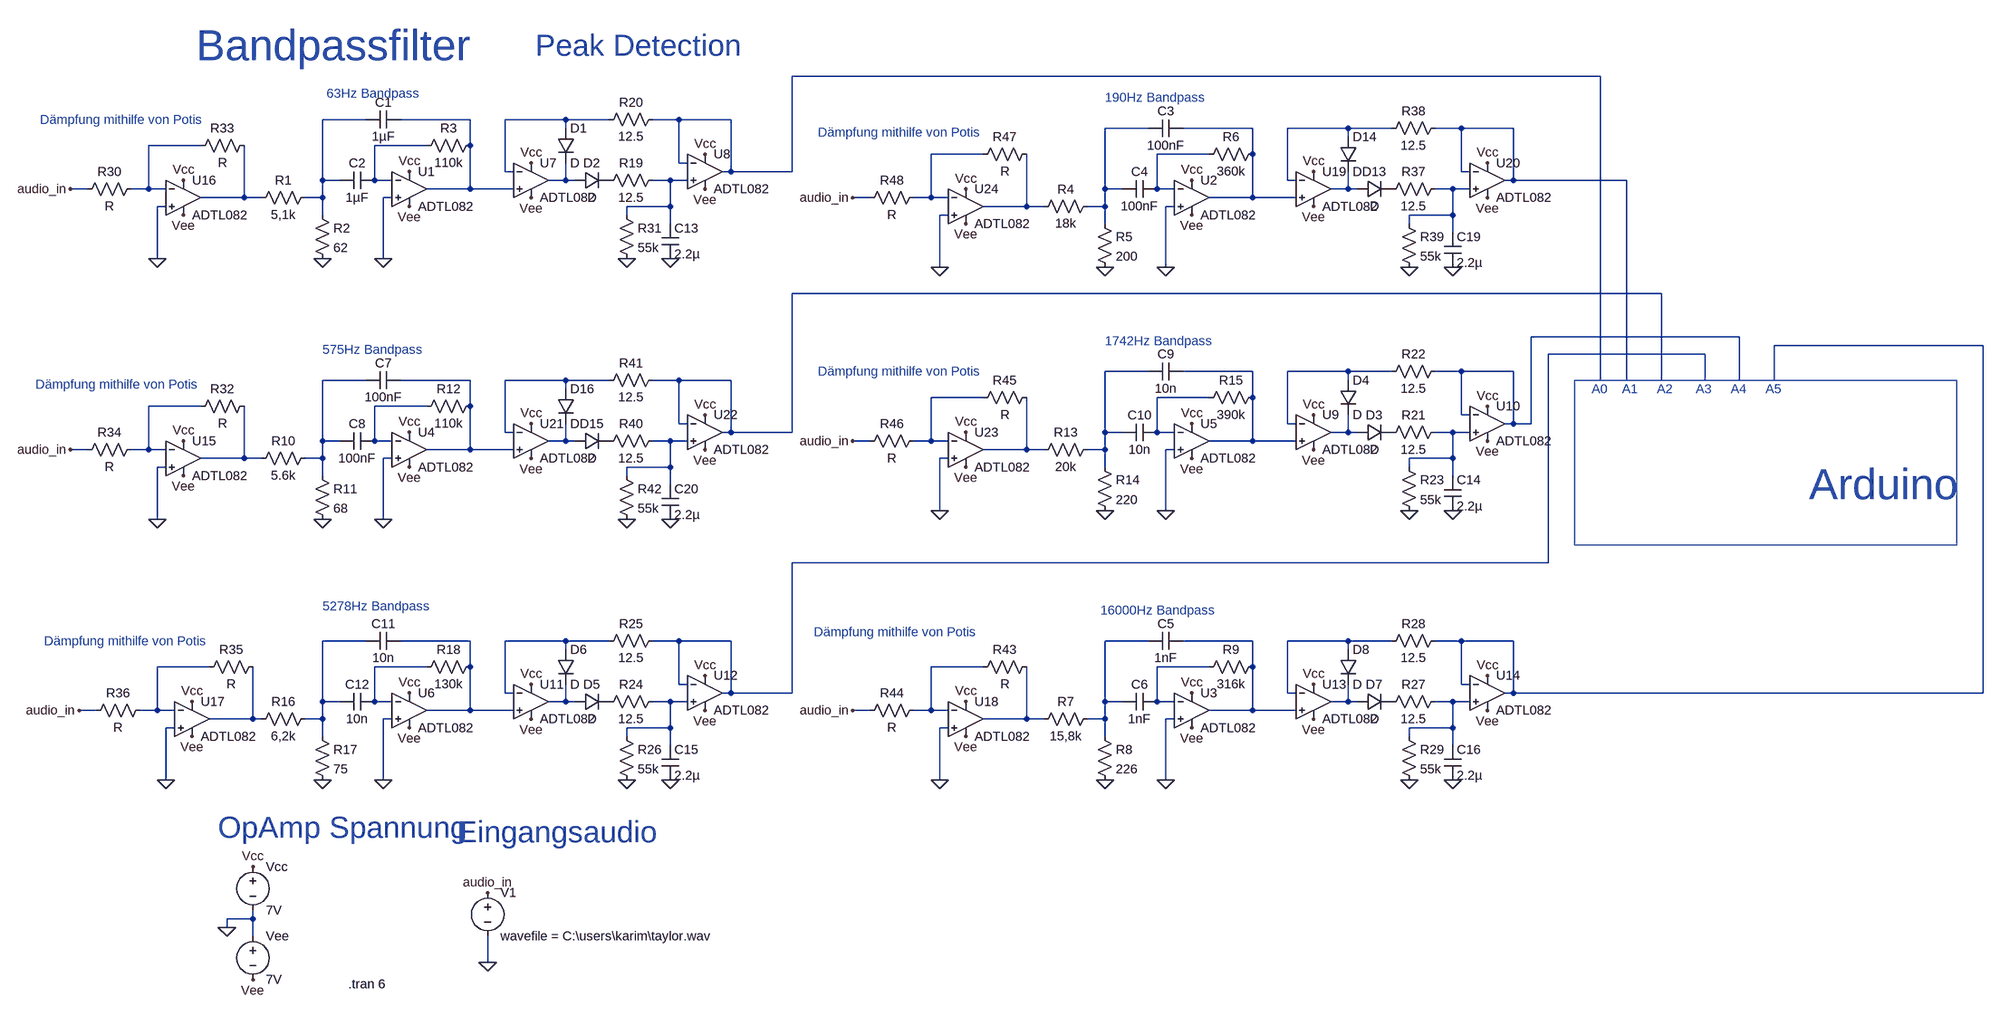
[diagram p0: schematic MSGEQ6.asc]
MSGEQ6.asc, the LTspice schematic file:
Version 4
SHEET 1 2336 1336
WIRE 1504 -416 16 -416
WIRE -768 -336 -848 -336
WIRE -576 -336 -704 -336
WIRE -400 -336 -512 -336
WIRE -320 -336 -400 -336
WIRE -192 -336 -240 -336
WIRE -96 -336 -192 -336
WIRE -400 -320 -400 -336
WIRE 672 -320 592 -320
WIRE 864 -320 736 -320
WIRE 1040 -320 928 -320
WIRE 1120 -320 1040 -320
WIRE 1248 -320 1200 -320
WIRE 1344 -320 1248 -320
WIRE 1040 -304 1040 -320
WIRE -1072 -288 -1168 -288
WIRE -656 -288 -752 -288
WIRE -576 -288 -576 -336
WIRE 368 -272 272 -272
WIRE 784 -272 688 -272
WIRE 864 -272 864 -320
WIRE -192 -256 -192 -336
WIRE -176 -256 -192 -256
WIRE -512 -240 -512 -336
WIRE -496 -240 -512 -240
WIRE -96 -240 -96 -336
WIRE -96 -240 -112 -240
WIRE 16 -240 16 -416
WIRE 16 -240 -96 -240
WIRE 1248 -240 1248 -320
WIRE 1264 -240 1248 -240
WIRE -848 -224 -848 -336
WIRE -816 -224 -848 -224
WIRE -752 -224 -752 -288
WIRE -720 -224 -752 -224
WIRE -400 -224 -400 -256
WIRE -400 -224 -432 -224
WIRE -384 -224 -400 -224
WIRE -208 -224 -240 -224
WIRE -176 -224 -208 -224
WIRE 928 -224 928 -320
WIRE 944 -224 928 -224
WIRE 1344 -224 1344 -320
WIRE 1344 -224 1328 -224
WIRE 1552 -224 1344 -224
WIRE -1280 -208 -1312 -208
WIRE -1168 -208 -1168 -288
WIRE -1168 -208 -1200 -208
WIRE -1136 -208 -1168 -208
WIRE -576 -208 -576 -288
WIRE -576 -208 -656 -208
WIRE -496 -208 -576 -208
WIRE 592 -208 592 -320
WIRE 624 -208 592 -208
WIRE 688 -208 688 -272
WIRE 720 -208 688 -208
WIRE 1040 -208 1040 -240
WIRE 1040 -208 1008 -208
WIRE 1056 -208 1040 -208
WIRE 1232 -208 1200 -208
WIRE 1264 -208 1232 -208
WIRE -992 -192 -992 -288
WIRE -992 -192 -1072 -192
WIRE -960 -192 -992 -192
WIRE -848 -192 -848 -224
WIRE -848 -192 -880 -192
WIRE -720 -192 -736 -192
WIRE 160 -192 128 -192
WIRE 272 -192 272 -272
WIRE 272 -192 240 -192
WIRE 304 -192 272 -192
WIRE 864 -192 864 -272
WIRE 864 -192 784 -192
WIRE 944 -192 864 -192
WIRE -1136 -176 -1152 -176
WIRE -208 -176 -208 -224
WIRE -208 -176 -288 -176
WIRE 448 -176 448 -272
WIRE 448 -176 368 -176
WIRE 480 -176 448 -176
WIRE 592 -176 592 -208
WIRE 592 -176 560 -176
WIRE 720 -176 704 -176
WIRE -848 -160 -848 -192
WIRE -288 -160 -288 -176
WIRE 304 -160 288 -160
WIRE 1232 -160 1232 -208
WIRE 1232 -160 1152 -160
WIRE -208 -144 -208 -176
WIRE 592 -144 592 -176
WIRE 1152 -144 1152 -160
WIRE 1232 -128 1232 -160
WIRE -1152 -80 -1152 -176
WIRE -736 -80 -736 -192
WIRE 288 -64 288 -160
WIRE 704 -64 704 -176
WIRE 1616 -16 16 -16
WIRE 1760 64 1376 64
WIRE 2208 80 1824 80
WIRE 1696 96 1408 96
WIRE 672 128 592 128
WIRE 864 128 736 128
WIRE 1040 128 928 128
WIRE 1120 128 1040 128
WIRE 1248 128 1200 128
WIRE 1344 128 1248 128
WIRE -768 144 -848 144
WIRE -576 144 -704 144
WIRE -400 144 -512 144
WIRE -320 144 -400 144
WIRE -192 144 -240 144
WIRE -96 144 -192 144
WIRE 1040 144 1040 128
WIRE 1504 144 1504 -416
WIRE 1552 144 1552 -224
WIRE 1616 144 1616 -16
WIRE 1696 144 1696 96
WIRE 1760 144 1760 64
WIRE 1824 144 1824 80
WIRE -400 160 -400 144
WIRE 368 176 272 176
WIRE 784 176 688 176
WIRE 864 176 864 128
WIRE -1072 192 -1168 192
WIRE -656 192 -752 192
WIRE -576 192 -576 144
WIRE 1248 208 1248 128
WIRE 1264 208 1248 208
WIRE -192 224 -192 144
WIRE -176 224 -192 224
WIRE 928 224 928 128
WIRE 944 224 928 224
WIRE 1344 224 1344 128
WIRE 1344 224 1328 224
WIRE 1376 224 1376 64
WIRE 1376 224 1344 224
WIRE -512 240 -512 144
WIRE -496 240 -512 240
WIRE -96 240 -96 144
WIRE -96 240 -112 240
WIRE 16 240 16 -16
WIRE 16 240 -96 240
WIRE 592 240 592 128
WIRE 624 240 592 240
WIRE 688 240 688 176
WIRE 720 240 688 240
WIRE 1040 240 1040 208
WIRE 1040 240 1008 240
WIRE 1056 240 1040 240
WIRE 1232 240 1200 240
WIRE 1264 240 1232 240
WIRE -848 256 -848 144
WIRE -816 256 -848 256
WIRE -752 256 -752 192
WIRE -720 256 -752 256
WIRE -400 256 -400 224
WIRE -400 256 -432 256
WIRE -384 256 -400 256
WIRE -208 256 -240 256
WIRE -176 256 -208 256
WIRE 160 256 128 256
WIRE 272 256 272 176
WIRE 272 256 240 256
WIRE 304 256 272 256
WIRE 864 256 864 176
WIRE 864 256 784 256
WIRE 944 256 864 256
WIRE -1280 272 -1312 272
WIRE -1168 272 -1168 192
WIRE -1168 272 -1200 272
WIRE -1136 272 -1168 272
WIRE -576 272 -576 192
WIRE -576 272 -656 272
WIRE -496 272 -576 272
WIRE 448 272 448 176
WIRE 448 272 368 272
WIRE 480 272 448 272
WIRE 592 272 592 240
WIRE 592 272 560 272
WIRE 720 272 704 272
WIRE -992 288 -992 192
WIRE -992 288 -1072 288
WIRE -960 288 -992 288
WIRE -848 288 -848 256
WIRE -848 288 -880 288
WIRE -720 288 -736 288
WIRE 304 288 288 288
WIRE 1232 288 1232 240
WIRE 1232 288 1152 288
WIRE -1136 304 -1152 304
WIRE -208 304 -208 256
WIRE -208 304 -288 304
WIRE 592 304 592 272
WIRE 1152 304 1152 288
WIRE -848 320 -848 288
WIRE -288 320 -288 304
WIRE 1232 320 1232 288
WIRE -208 336 -208 304
WIRE 288 384 288 288
WIRE 704 384 704 272
WIRE -1152 400 -1152 304
WIRE -736 400 -736 288
WIRE 1408 480 1408 96
WIRE 1408 480 16 480
WIRE -768 624 -848 624
WIRE -576 624 -704 624
WIRE -400 624 -512 624
WIRE -320 624 -400 624
WIRE -192 624 -240 624
WIRE -96 624 -192 624
WIRE 672 624 592 624
WIRE 864 624 736 624
WIRE 1040 624 928 624
WIRE 1120 624 1040 624
WIRE 1248 624 1200 624
WIRE 1344 624 1248 624
WIRE -400 640 -400 624
WIRE 1040 640 1040 624
WIRE -1056 672 -1152 672
WIRE -656 672 -752 672
WIRE -576 672 -576 624
WIRE 368 672 272 672
WIRE 784 672 688 672
WIRE 864 672 864 624
WIRE -192 704 -192 624
WIRE -176 704 -192 704
WIRE 1248 704 1248 624
WIRE 1264 704 1248 704
WIRE -512 720 -512 624
WIRE -496 720 -512 720
WIRE -96 720 -96 624
WIRE -96 720 -112 720
WIRE 16 720 16 480
WIRE 16 720 -96 720
WIRE 928 720 928 624
WIRE 944 720 928 720
WIRE 1344 720 1344 624
WIRE 1344 720 1328 720
WIRE 2208 720 2208 80
WIRE 2208 720 1344 720
WIRE -848 736 -848 624
WIRE -816 736 -848 736
WIRE -752 736 -752 672
WIRE -720 736 -752 736
WIRE -400 736 -400 704
WIRE -400 736 -432 736
WIRE -384 736 -400 736
WIRE -208 736 -240 736
WIRE -176 736 -208 736
WIRE 592 736 592 624
WIRE 624 736 592 736
WIRE 688 736 688 672
WIRE 720 736 688 736
WIRE 1040 736 1040 704
WIRE 1040 736 1008 736
WIRE 1056 736 1040 736
WIRE 1232 736 1200 736
WIRE 1264 736 1232 736
WIRE -1264 752 -1296 752
WIRE -1152 752 -1152 672
WIRE -1152 752 -1184 752
WIRE -1120 752 -1152 752
WIRE -576 752 -576 672
WIRE -576 752 -656 752
WIRE -496 752 -576 752
WIRE 160 752 128 752
WIRE 272 752 272 672
WIRE 272 752 240 752
WIRE 304 752 272 752
WIRE 864 752 864 672
WIRE 864 752 784 752
WIRE 944 752 864 752
WIRE -976 768 -976 672
WIRE -976 768 -1056 768
WIRE -960 768 -976 768
WIRE -848 768 -848 736
WIRE -848 768 -880 768
WIRE -720 768 -736 768
WIRE 448 768 448 672
WIRE 448 768 368 768
WIRE 480 768 448 768
WIRE 592 768 592 736
WIRE 592 768 560 768
WIRE 720 768 704 768
WIRE -1120 784 -1136 784
WIRE -208 784 -208 736
WIRE -208 784 -288 784
WIRE 304 784 288 784
WIRE 1232 784 1232 736
WIRE 1232 784 1152 784
WIRE -848 800 -848 768
WIRE -288 800 -288 784
WIRE 592 800 592 768
WIRE 1152 800 1152 784
WIRE -208 816 -208 784
WIRE 1232 816 1232 784
WIRE -1136 880 -1136 784
WIRE -736 880 -736 768
WIRE 288 880 288 784
WIRE 704 880 704 768
WIRE -976 1136 -976 1120
WIRE -976 1136 -1024 1136
WIRE -1024 1152 -1024 1136
WIRE -976 1168 -976 1136
WIRE -544 1216 -544 1168
FLAG -544 1216 0
FLAG -848 -80 0
FLAG -688 -240 Vcc
FLAG -976 1040 Vcc
FLAG -976 1248 Vee
FLAG -1024 1152 0
FLAG -688 -176 Vee
FLAG -736 -80 0
FLAG 592 -64 0
FLAG 752 -224 Vcc
FLAG 752 -160 Vee
FLAG 704 -64 0
FLAG 592 880 0
FLAG 752 720 Vcc
FLAG 752 784 Vee
FLAG 704 880 0
FLAG -848 400 0
FLAG -688 240 Vcc
FLAG -688 304 Vee
FLAG -736 400 0
FLAG 592 384 0
FLAG 752 224 Vcc
FLAG 752 288 Vee
FLAG 704 384 0
FLAG -848 880 0
FLAG -688 720 Vcc
FLAG -688 784 Vee
FLAG -736 880 0
FLAG -544 1088 audio_in
FLAG -1312 -208 audio_in
FLAG 128 -192 audio_in
FLAG -1312 272 audio_in
FLAG 128 752 audio_in
FLAG -1296 752 audio_in
FLAG 128 256 audio_in
FLAG -208 -80 0
FLAG -144 -272 Vcc
FLAG -464 -256 Vcc
FLAG -464 -192 Vee
FLAG -144 -208 Vee
FLAG -288 -80 0
FLAG 1232 -64 0
FLAG 1296 -256 Vcc
FLAG 976 -240 Vcc
FLAG 976 -176 Vee
FLAG 1296 -192 Vee
FLAG 1152 -64 0
FLAG -208 400 0
FLAG -144 208 Vcc
FLAG -464 224 Vcc
FLAG -464 288 Vee
FLAG -144 272 Vee
FLAG -288 400 0
FLAG 1232 384 0
FLAG 1296 192 Vcc
FLAG 976 208 Vcc
FLAG 976 272 Vee
FLAG 1296 256 Vee
FLAG 1152 384 0
FLAG -208 880 0
FLAG -144 688 Vcc
FLAG -464 704 Vcc
FLAG -464 768 Vee
FLAG -144 752 Vee
FLAG -288 880 0
FLAG 1232 880 0
FLAG 1296 688 Vcc
FLAG 976 704 Vcc
FLAG 976 768 Vee
FLAG 1296 752 Vee
FLAG 1152 880 0
FLAG -1104 -224 Vcc
FLAG -1104 -160 Vee
FLAG -1152 -80 0
FLAG -1104 256 Vcc
FLAG -1104 320 Vee
FLAG -1152 400 0
FLAG -1088 736 Vcc
FLAG -1088 800 Vee
FLAG -1136 880 0
FLAG 336 736 Vcc
FLAG 336 800 Vee
FLAG 288 880 0
FLAG 336 240 Vcc
FLAG 336 304 Vee
FLAG 288 384 0
FLAG 336 -208 Vcc
FLAG 336 -144 Vee
FLAG 288 -64 0
SYMBOL voltage -544 1072 R0
SYMATTR InstName V1
SYMATTR Value wavefile = C:\users\karim\taylor.wav
SYMBOL res -864 -208 R90
WINDOW 0 0 56 VBottom 2
WINDOW 3 32 56 VTop 2
SYMATTR InstName R1
SYMATTR Value 5,1k
SYMBOL cap -704 -352 R90
WINDOW 0 0 32 VBottom 2
WINDOW 3 32 32 VTop 2
SYMATTR InstName C1
SYMATTR Value 1µF
SYMBOL res -864 -176 R0
SYMATTR InstName R2
SYMATTR Value 62
SYMBOL cap -752 -240 R90
WINDOW 0 0 32 VBottom 2
WINDOW 3 32 32 VTop 2
SYMATTR InstName C2
SYMATTR Value 1µF
SYMBOL res -560 -304 R90
WINDOW 0 0 56 VBottom 2
WINDOW 3 32 56 VTop 2
SYMATTR InstName R3
SYMATTR Value 110k
SYMBOL OpAmps\\ADTL082 -688 -272 R0
SYMATTR InstName U1
SYMBOL voltage -976 1024 R0
WINDOW 123 0 0 Left 0
WINDOW 39 0 0 Left 0
SYMATTR InstName Vcc
SYMATTR Value 7V
SYMBOL voltage -976 1152 R0
WINDOW 123 0 0 Left 0
WINDOW 39 0 0 Left 0
SYMATTR InstName Vee
SYMATTR Value 7V
SYMBOL res 576 -192 R90
WINDOW 0 0 56 VBottom 2
WINDOW 3 32 56 VTop 2
SYMATTR InstName R4
SYMATTR Value 18k
SYMBOL cap 736 -336 R90
WINDOW 0 0 32 VBottom 2
WINDOW 3 32 32 VTop 2
SYMATTR InstName C3
SYMATTR Value 100nF
SYMBOL res 576 -160 R0
SYMATTR InstName R5
SYMATTR Value 200
SYMBOL cap 688 -224 R90
WINDOW 0 0 32 VBottom 2
WINDOW 3 32 32 VTop 2
SYMATTR InstName C4
SYMATTR Value 100nF
SYMBOL res 880 -288 R90
WINDOW 0 0 56 VBottom 2
WINDOW 3 32 56 VTop 2
SYMATTR InstName R6
SYMATTR Value 360k
SYMBOL OpAmps\\ADTL082 752 -256 R0
SYMATTR InstName U2
SYMBOL res 576 752 R90
WINDOW 0 0 56 VBottom 2
WINDOW 3 32 56 VTop 2
SYMATTR InstName R7
SYMATTR Value 15,8k
SYMBOL cap 736 608 R90
WINDOW 0 0 32 VBottom 2
WINDOW 3 32 32 VTop 2
SYMATTR InstName C5
SYMATTR Value 1nF
SYMBOL res 576 784 R0
SYMATTR InstName R8
SYMATTR Value 226
SYMBOL cap 688 720 R90
WINDOW 0 0 32 VBottom 2
WINDOW 3 32 32 VTop 2
SYMATTR InstName C6
SYMATTR Value 1nF
SYMBOL res 880 656 R90
WINDOW 0 0 56 VBottom 2
WINDOW 3 32 56 VTop 2
SYMATTR InstName R9
SYMATTR Value 316k
SYMBOL OpAmps\\ADTL082 752 688 R0
SYMATTR InstName U3
SYMBOL res -864 272 R90
WINDOW 0 0 56 VBottom 2
WINDOW 3 32 56 VTop 2
SYMATTR InstName R10
SYMATTR Value 5.6k
SYMBOL cap -704 128 R90
WINDOW 0 0 32 VBottom 2
WINDOW 3 32 32 VTop 2
SYMATTR InstName C7
SYMATTR Value 100nF
SYMBOL res -864 304 R0
SYMATTR InstName R11
SYMATTR Value 68
SYMBOL cap -752 240 R90
WINDOW 0 0 32 VBottom 2
WINDOW 3 32 32 VTop 2
SYMATTR InstName C8
SYMATTR Value 100nF
SYMBOL res -560 176 R90
WINDOW 0 0 56 VBottom 2
WINDOW 3 32 56 VTop 2
SYMATTR InstName R12
SYMATTR Value 110k
SYMBOL OpAmps\\ADTL082 -688 208 R0
SYMATTR InstName U4
SYMBOL res 576 256 R90
WINDOW 0 0 56 VBottom 2
WINDOW 3 32 56 VTop 2
SYMATTR InstName R13
SYMATTR Value 20k
SYMBOL cap 736 112 R90
WINDOW 0 0 32 VBottom 2
WINDOW 3 32 32 VTop 2
SYMATTR InstName C9
SYMATTR Value 10n
SYMBOL res 576 288 R0
SYMATTR InstName R14
SYMATTR Value 220
SYMBOL cap 688 224 R90
WINDOW 0 0 32 VBottom 2
WINDOW 3 32 32 VTop 2
SYMATTR InstName C10
SYMATTR Value 10n
SYMBOL res 880 160 R90
WINDOW 0 0 56 VBottom 2
WINDOW 3 32 56 VTop 2
SYMATTR InstName R15
SYMATTR Value 390k
SYMBOL OpAmps\\ADTL082 752 192 R0
SYMATTR InstName U5
SYMBOL res -864 752 R90
WINDOW 0 0 56 VBottom 2
WINDOW 3 32 56 VTop 2
SYMATTR InstName R16
SYMATTR Value 6,2k
SYMBOL cap -704 608 R90
WINDOW 0 0 32 VBottom 2
WINDOW 3 32 32 VTop 2
SYMATTR InstName C11
SYMATTR Value 10n
SYMBOL res -864 784 R0
SYMATTR InstName R17
SYMATTR Value 75
SYMBOL cap -752 720 R90
WINDOW 0 0 32 VBottom 2
WINDOW 3 32 32 VTop 2
SYMATTR InstName C12
SYMATTR Value 10n
SYMBOL res -560 656 R90
WINDOW 0 0 56 VBottom 2
WINDOW 3 32 56 VTop 2
SYMATTR InstName R18
SYMATTR Value 130k
SYMBOL OpAmps\\ADTL082 -688 688 R0
SYMATTR InstName U6
SYMBOL OpAmps\\ADTL082 -464 -288 R0
SYMATTR InstName U7
SYMBOL OpAmps\\ADTL082 -144 -304 R0
SYMATTR InstName U8
SYMBOL diode -384 -208 R270
WINDOW 0 32 32 VTop 2
WINDOW 3 0 32 VBottom 2
SYMATTR InstName D2
SYMBOL res -224 -240 R90
WINDOW 0 0 56 VBottom 2
WINDOW 3 32 56 VTop 2
SYMATTR InstName R19
SYMATTR Value 12.5
SYMBOL cap -224 -144 R0
SYMATTR InstName C13
SYMATTR Value 2.2µ
SYMBOL res -224 -352 R90
WINDOW 0 0 56 VBottom 2
WINDOW 3 32 56 VTop 2
SYMATTR InstName R20
SYMATTR Value 12.5
SYMBOL res -304 -176 R0
SYMATTR InstName R31
SYMATTR Value 55k
SYMBOL diode -416 -320 R0
SYMATTR InstName D1
SYMBOL OpAmps\\ADTL082 976 -272 R0
SYMATTR InstName U19
SYMBOL OpAmps\\ADTL082 1296 -288 R0
SYMATTR InstName U20
SYMBOL diode 1056 -192 R270
WINDOW 0 32 32 VTop 2
WINDOW 3 0 32 VBottom 2
SYMATTR InstName D13
SYMBOL res 1216 -224 R90
WINDOW 0 0 56 VBottom 2
WINDOW 3 32 56 VTop 2
SYMATTR InstName R37
SYMATTR Value 12.5
SYMBOL cap 1216 -128 R0
SYMATTR InstName C19
SYMATTR Value 2.2µ
SYMBOL res 1216 -336 R90
WINDOW 0 0 56 VBottom 2
WINDOW 3 32 56 VTop 2
SYMATTR InstName R38
SYMATTR Value 12.5
SYMBOL res 1136 -160 R0
SYMATTR InstName R39
SYMATTR Value 55k
SYMBOL diode 1024 -304 R0
SYMATTR InstName D14
SYMBOL OpAmps\\ADTL082 -464 192 R0
SYMATTR InstName U21
SYMBOL OpAmps\\ADTL082 -144 176 R0
SYMATTR InstName U22
SYMBOL diode -384 272 R270
WINDOW 0 32 32 VTop 2
WINDOW 3 0 32 VBottom 2
SYMATTR InstName D15
SYMBOL res -224 240 R90
WINDOW 0 0 56 VBottom 2
WINDOW 3 32 56 VTop 2
SYMATTR InstName R40
SYMATTR Value 12.5
SYMBOL cap -224 336 R0
SYMATTR InstName C20
SYMATTR Value 2.2µ
SYMBOL res -224 128 R90
WINDOW 0 0 56 VBottom 2
WINDOW 3 32 56 VTop 2
SYMATTR InstName R41
SYMATTR Value 12.5
SYMBOL res -304 304 R0
SYMATTR InstName R42
SYMATTR Value 55k
SYMBOL diode -416 160 R0
SYMATTR InstName D16
SYMBOL OpAmps\\ADTL082 976 176 R0
SYMATTR InstName U9
SYMBOL OpAmps\\ADTL082 1296 160 R0
SYMATTR InstName U10
SYMBOL diode 1056 256 R270
WINDOW 0 32 32 VTop 2
WINDOW 3 0 32 VBottom 2
SYMATTR InstName D3
SYMBOL res 1216 224 R90
WINDOW 0 0 56 VBottom 2
WINDOW 3 32 56 VTop 2
SYMATTR InstName R21
SYMATTR Value 12.5
SYMBOL cap 1216 320 R0
SYMATTR InstName C14
SYMATTR Value 2.2µ
SYMBOL res 1216 112 R90
WINDOW 0 0 56 VBottom 2
WINDOW 3 32 56 VTop 2
SYMATTR InstName R22
SYMATTR Value 12.5
SYMBOL res 1136 288 R0
SYMATTR InstName R23
SYMATTR Value 55k
SYMBOL diode 1024 144 R0
SYMATTR InstName D4
SYMBOL OpAmps\\ADTL082 -464 672 R0
SYMATTR InstName U11
SYMBOL OpAmps\\ADTL082 -144 656 R0
SYMATTR InstName U12
SYMBOL diode -384 752 R270
WINDOW 0 32 32 VTop 2
WINDOW 3 0 32 VBottom 2
SYMATTR InstName D5
SYMBOL res -224 720 R90
WINDOW 0 0 56 VBottom 2
WINDOW 3 32 56 VTop 2
SYMATTR InstName R24
SYMATTR Value 12.5
SYMBOL cap -224 816 R0
SYMATTR InstName C15
SYMATTR Value 2.2µ
SYMBOL res -224 608 R90
WINDOW 0 0 56 VBottom 2
WINDOW 3 32 56 VTop 2
SYMATTR InstName R25
SYMATTR Value 12.5
SYMBOL res -304 784 R0
SYMATTR InstName R26
SYMATTR Value 55k
SYMBOL diode -416 640 R0
SYMATTR InstName D6
SYMBOL OpAmps\\ADTL082 976 672 R0
SYMATTR InstName U13
SYMBOL OpAmps\\ADTL082 1296 656 R0
SYMATTR InstName U14
SYMBOL diode 1056 752 R270
WINDOW 0 32 32 VTop 2
WINDOW 3 0 32 VBottom 2
SYMATTR InstName D7
SYMBOL res 1216 720 R90
WINDOW 0 0 56 VBottom 2
WINDOW 3 32 56 VTop 2
SYMATTR InstName R27
SYMATTR Value 12.5
SYMBOL cap 1216 816 R0
SYMATTR InstName C16
SYMATTR Value 2.2µ
SYMBOL res 1216 608 R90
WINDOW 0 0 56 VBottom 2
WINDOW 3 32 56 VTop 2
SYMATTR InstName R28
SYMATTR Value 12.5
SYMBOL res 1136 784 R0
SYMATTR InstName R29
SYMATTR Value 55k
SYMBOL diode 1024 640 R0
SYMATTR InstName D8
SYMBOL OpAmps\\ADTL082 -1104 -256 R0
SYMATTR InstName U16
SYMBOL res -976 -304 R90
WINDOW 0 0 56 VBottom 2
WINDOW 3 32 56 VTop 2
SYMATTR InstName R33
SYMBOL res -1184 -224 R90
WINDOW 0 0 56 VBottom 2
WINDOW 3 32 56 VTop 2
SYMATTR InstName R30
SYMBOL OpAmps\\ADTL082 -1104 224 R0
SYMATTR InstName U15
SYMBOL res -976 176 R90
WINDOW 0 0 56 VBottom 2
WINDOW 3 32 56 VTop 2
SYMATTR InstName R32
SYMBOL res -1184 256 R90
WINDOW 0 0 56 VBottom 2
WINDOW 3 32 56 VTop 2
SYMATTR InstName R34
SYMBOL OpAmps\\ADTL082 -1088 704 R0
SYMATTR InstName U17
SYMBOL res -960 656 R90
WINDOW 0 0 56 VBottom 2
WINDOW 3 32 56 VTop 2
SYMATTR InstName R35
SYMBOL res -1168 736 R90
WINDOW 0 0 56 VBottom 2
WINDOW 3 32 56 VTop 2
SYMATTR InstName R36
SYMBOL OpAmps\\ADTL082 336 704 R0
SYMATTR InstName U18
SYMBOL res 464 656 R90
WINDOW 0 0 56 VBottom 2
WINDOW 3 32 56 VTop 2
SYMATTR InstName R43
SYMBOL res 256 736 R90
WINDOW 0 0 56 VBottom 2
WINDOW 3 32 56 VTop 2
SYMATTR InstName R44
SYMBOL OpAmps\\ADTL082 336 208 R0
SYMATTR InstName U23
SYMBOL res 464 160 R90
WINDOW 0 0 56 VBottom 2
WINDOW 3 32 56 VTop 2
SYMATTR InstName R45
SYMBOL res 256 240 R90
WINDOW 0 0 56 VBottom 2
WINDOW 3 32 56 VTop 2
SYMATTR InstName R46
SYMBOL OpAmps\\ADTL082 336 -240 R0
SYMATTR InstName U24
SYMBOL res 464 -288 R90
WINDOW 0 0 56 VBottom 2
WINDOW 3 32 56 VTop 2
SYMATTR InstName R47
SYMBOL res 256 -208 R90
WINDOW 0 0 56 VBottom 2
WINDOW 3 32 56 VTop 2
SYMATTR InstName R48
TEXT -840 -384 Left 2 ;63Hz Bandpass
TEXT 592 -376 Left 2 ;190Hz Bandpass
TEXT 584 568 Left 2 ;16000Hz Bandpass
TEXT -848 88 Left 2 ;575Hz Bandpass
TEXT 592 72 Left 2 ;1742Hz Bandpass
TEXT -848 560 Left 2 ;5278Hz Bandpass
TEXT -800 1256 Left 2 !.tran 6
TEXT -1080 -472 Left 6 ;Bandpassfilter
TEXT -456 -472 Left 5 ;Peak Detection
TEXT -1040 968 Left 5 ;OpAmp Spannung
TEXT -600 976 Left 5 ;Eingangsaudio
TEXT 1888 336 Left 6 ;Arduino
TEXT 1488 160 Left 2 ;A0
TEXT 1544 160 Left 2 ;A1
TEXT 1608 160 Left 2 ;A2
TEXT 1680 160 Left 2 ;A3
TEXT 1744 160 Left 2 ;A4
TEXT 1808 160 Left 2 ;A5
TEXT 56 608 Left 2 ;Dämpfung mithilfe von Potis
TEXT 64 128 Left 2 ;Dämpfung mithilfe von Potis
TEXT 64 -312 Left 2 ;Dämpfung mithilfe von Potis
TEXT -1368 -336 Left 2 ;Dämpfung mithilfe von Potis
TEXT -1376 152 Left 2 ;Dämpfung mithilfe von Potis
TEXT -1360 624 Left 2 ;Dämpfung mithilfe von Potis
RECTANGLE Normal 2160 448 1456 144

The netlist it stands for:
* MSGEQ6.asc
V1 audio_in 0 wavefile = C:\users\karim\taylor.wav
R1 N002 N017 5,1k
C1 N003 N002 1µF
R2 N002 0 62
C2 N010 N002 1µF
R3 N003 N010 110k
XU1 0 N010 Vcc Vee N003 ADTL082  ; pins In+ In- V+ V- OUT
Vcc Vcc 0 7V
Vee 0 Vee 7V
R4 N005 N018 18k
C3 N006 N005 100nF
R5 N005 0 200
C4 N012 N005 100nF
R6 N006 N012 360k
XU2 0 N012 Vcc Vee N006 ADTL082  ; pins In+ In- V+ V- OUT
R7 N042 N054 15,8k
C5 N043 N042 1nF
R8 N042 0 226
C6 N048 N042 1nF
R9 N043 N048 316k
XU3 0 N048 Vcc Vee N043 ADTL082  ; pins In+ In- V+ V- OUT
R10 N026 N038 5.6k
C7 N027 N026 100nF
R11 N026 0 68
C8 N032 N026 100nF
R12 N027 N032 110k
XU4 0 N032 Vcc Vee N027 ADTL082  ; pins In+ In- V+ V- OUT
R13 N023 N037 20k
C9 N024 N023 10n
R14 N023 0 220
C10 N030 N023 10n
R15 N024 N030 390k
XU5 0 N030 Vcc Vee N024 ADTL082  ; pins In+ In- V+ V- OUT
R16 N039 N053 6,2k
C11 N040 N039 10n
R17 N039 0 75
C12 N046 N039 10n
R18 N040 N046 130k
XU6 0 N046 Vcc Vee N040 ADTL082  ; pins In+ In- V+ V- OUT
XU7 N003 N004 Vcc Vee N013 ADTL082  ; pins In+ In- V+ V- OUT
XU8 N014 N001 Vcc Vee N001 ADTL082  ; pins In+ In- V+ V- OUT
D2 N013 P001 D
R19 N014 P001 12.5
C13 N014 0 2.2µ
R20 N001 N004 12.5
R31 N014 0 55k
D1 N004 N013 D
XU19 N006 N007 Vcc Vee N015 ADTL082  ; pins In+ In- V+ V- OUT
XU20 N016 N008 Vcc Vee N008 ADTL082  ; pins In+ In- V+ V- OUT
D13 N015 P002 D
R37 N016 P002 12.5
C19 N016 0 2.2µ
R38 N008 N007 12.5
R39 N016 0 55k
D14 N007 N015 D
XU21 N027 N028 Vcc Vee N035 ADTL082  ; pins In+ In- V+ V- OUT
XU22 N036 N019 Vcc Vee N019 ADTL082  ; pins In+ In- V+ V- OUT
D15 N035 P003 D
R40 N036 P003 12.5
C20 N036 0 2.2µ
R41 N019 N028 12.5
R42 N036 0 55k
D16 N028 N035 D
XU9 N024 N025 Vcc Vee N033 ADTL082  ; pins In+ In- V+ V- OUT
XU10 N034 N020 Vcc Vee N020 ADTL082  ; pins In+ In- V+ V- OUT
D3 N033 P004 D
R21 N034 P004 12.5
C14 N034 0 2.2µ
R22 N020 N025 12.5
R23 N034 0 55k
D4 N025 N033 D
XU11 N040 N041 Vcc Vee N049 ADTL082  ; pins In+ In- V+ V- OUT
XU12 N050 N022 Vcc Vee N022 ADTL082  ; pins In+ In- V+ V- OUT
D5 N049 P005 D
R24 N050 P005 12.5
C15 N050 0 2.2µ
R25 N022 N041 12.5
R26 N050 0 55k
D6 N041 N049 D
XU13 N043 N044 Vcc Vee N051 ADTL082  ; pins In+ In- V+ V- OUT
XU14 N052 N021 Vcc Vee N021 ADTL082  ; pins In+ In- V+ V- OUT
D7 N051 P006 D
R27 N052 P006 12.5
C16 N052 0 2.2µ
R28 N021 N044 12.5
R29 N052 0 55k
D8 N044 N051 D
XU16 0 N009 Vcc Vee N017 ADTL082  ; pins In+ In- V+ V- OUT
R33 N017 N009 R
R30 N009 audio_in R
XU15 0 N031 Vcc Vee N038 ADTL082  ; pins In+ In- V+ V- OUT
R32 N038 N031 R
R34 N031 audio_in R
XU17 0 N045 Vcc Vee N053 ADTL082  ; pins In+ In- V+ V- OUT
R35 N053 N045 R
R36 N045 audio_in R
XU18 0 N047 Vcc Vee N054 ADTL082  ; pins In+ In- V+ V- OUT
R43 N054 N047 R
R44 N047 audio_in R
XU23 0 N029 Vcc Vee N037 ADTL082  ; pins In+ In- V+ V- OUT
R45 N037 N029 R
R46 N029 audio_in R
XU24 0 N011 Vcc Vee N018 ADTL082  ; pins In+ In- V+ V- OUT
R47 N018 N011 R
R48 N011 audio_in R
.model D D
.lib standard.dio
* 63Hz Bandpass
* 190Hz Bandpass
* 16000Hz Bandpass
* 575Hz Bandpass
* 1742Hz Bandpass
* 5278Hz Bandpass
.tran 6
* Bandpassfilter
* Peak Detection
* OpAmp Spannung
* Eingangsaudio
* Arduino
* A0
* A1
* A2
* A3
* A4
* A5
* Dämpfung mithilfe von Potis
* Dämpfung mithilfe von Potis
* Dämpfung mithilfe von Potis
* Dämpfung mithilfe von Potis
* Dämpfung mithilfe von Potis
* Dämpfung mithilfe von Potis
.lib ADI.lib
.backanno
.end